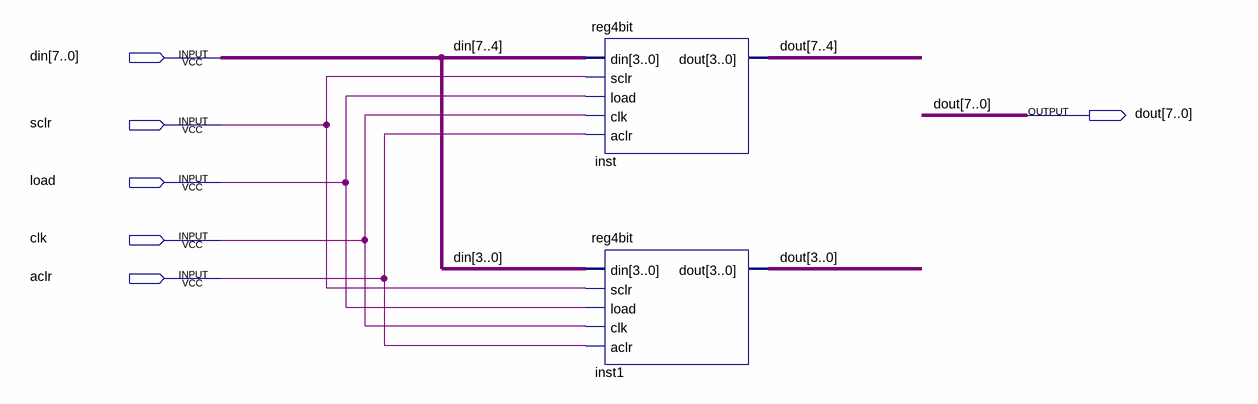
[diagram p0: schematic sheet]
// Quartus schematic reg8bit.bdf as structural Verilog: 2 symbols, 6 pins
module reg8bit (
  input  [7:0] din,
  input  sclr,
  input  load,
  input  clk,
  input  aclr,
  output [7:0] dout
);

  reg4bit inst (.din(din[7:4]), .sclr(sclr), .load(load), .clk(clk), .aclr(aclr), .dout(dout[7:4]));
  reg4bit inst1 (.din(din[3:0]), .sclr(sclr), .load(load), .clk(clk), .aclr(aclr), .dout(dout[3:0]));
endmodule
